# Altium schematic sheet gs358贴片改插件方案20260723.SchDoc
size 400 x 400 mm
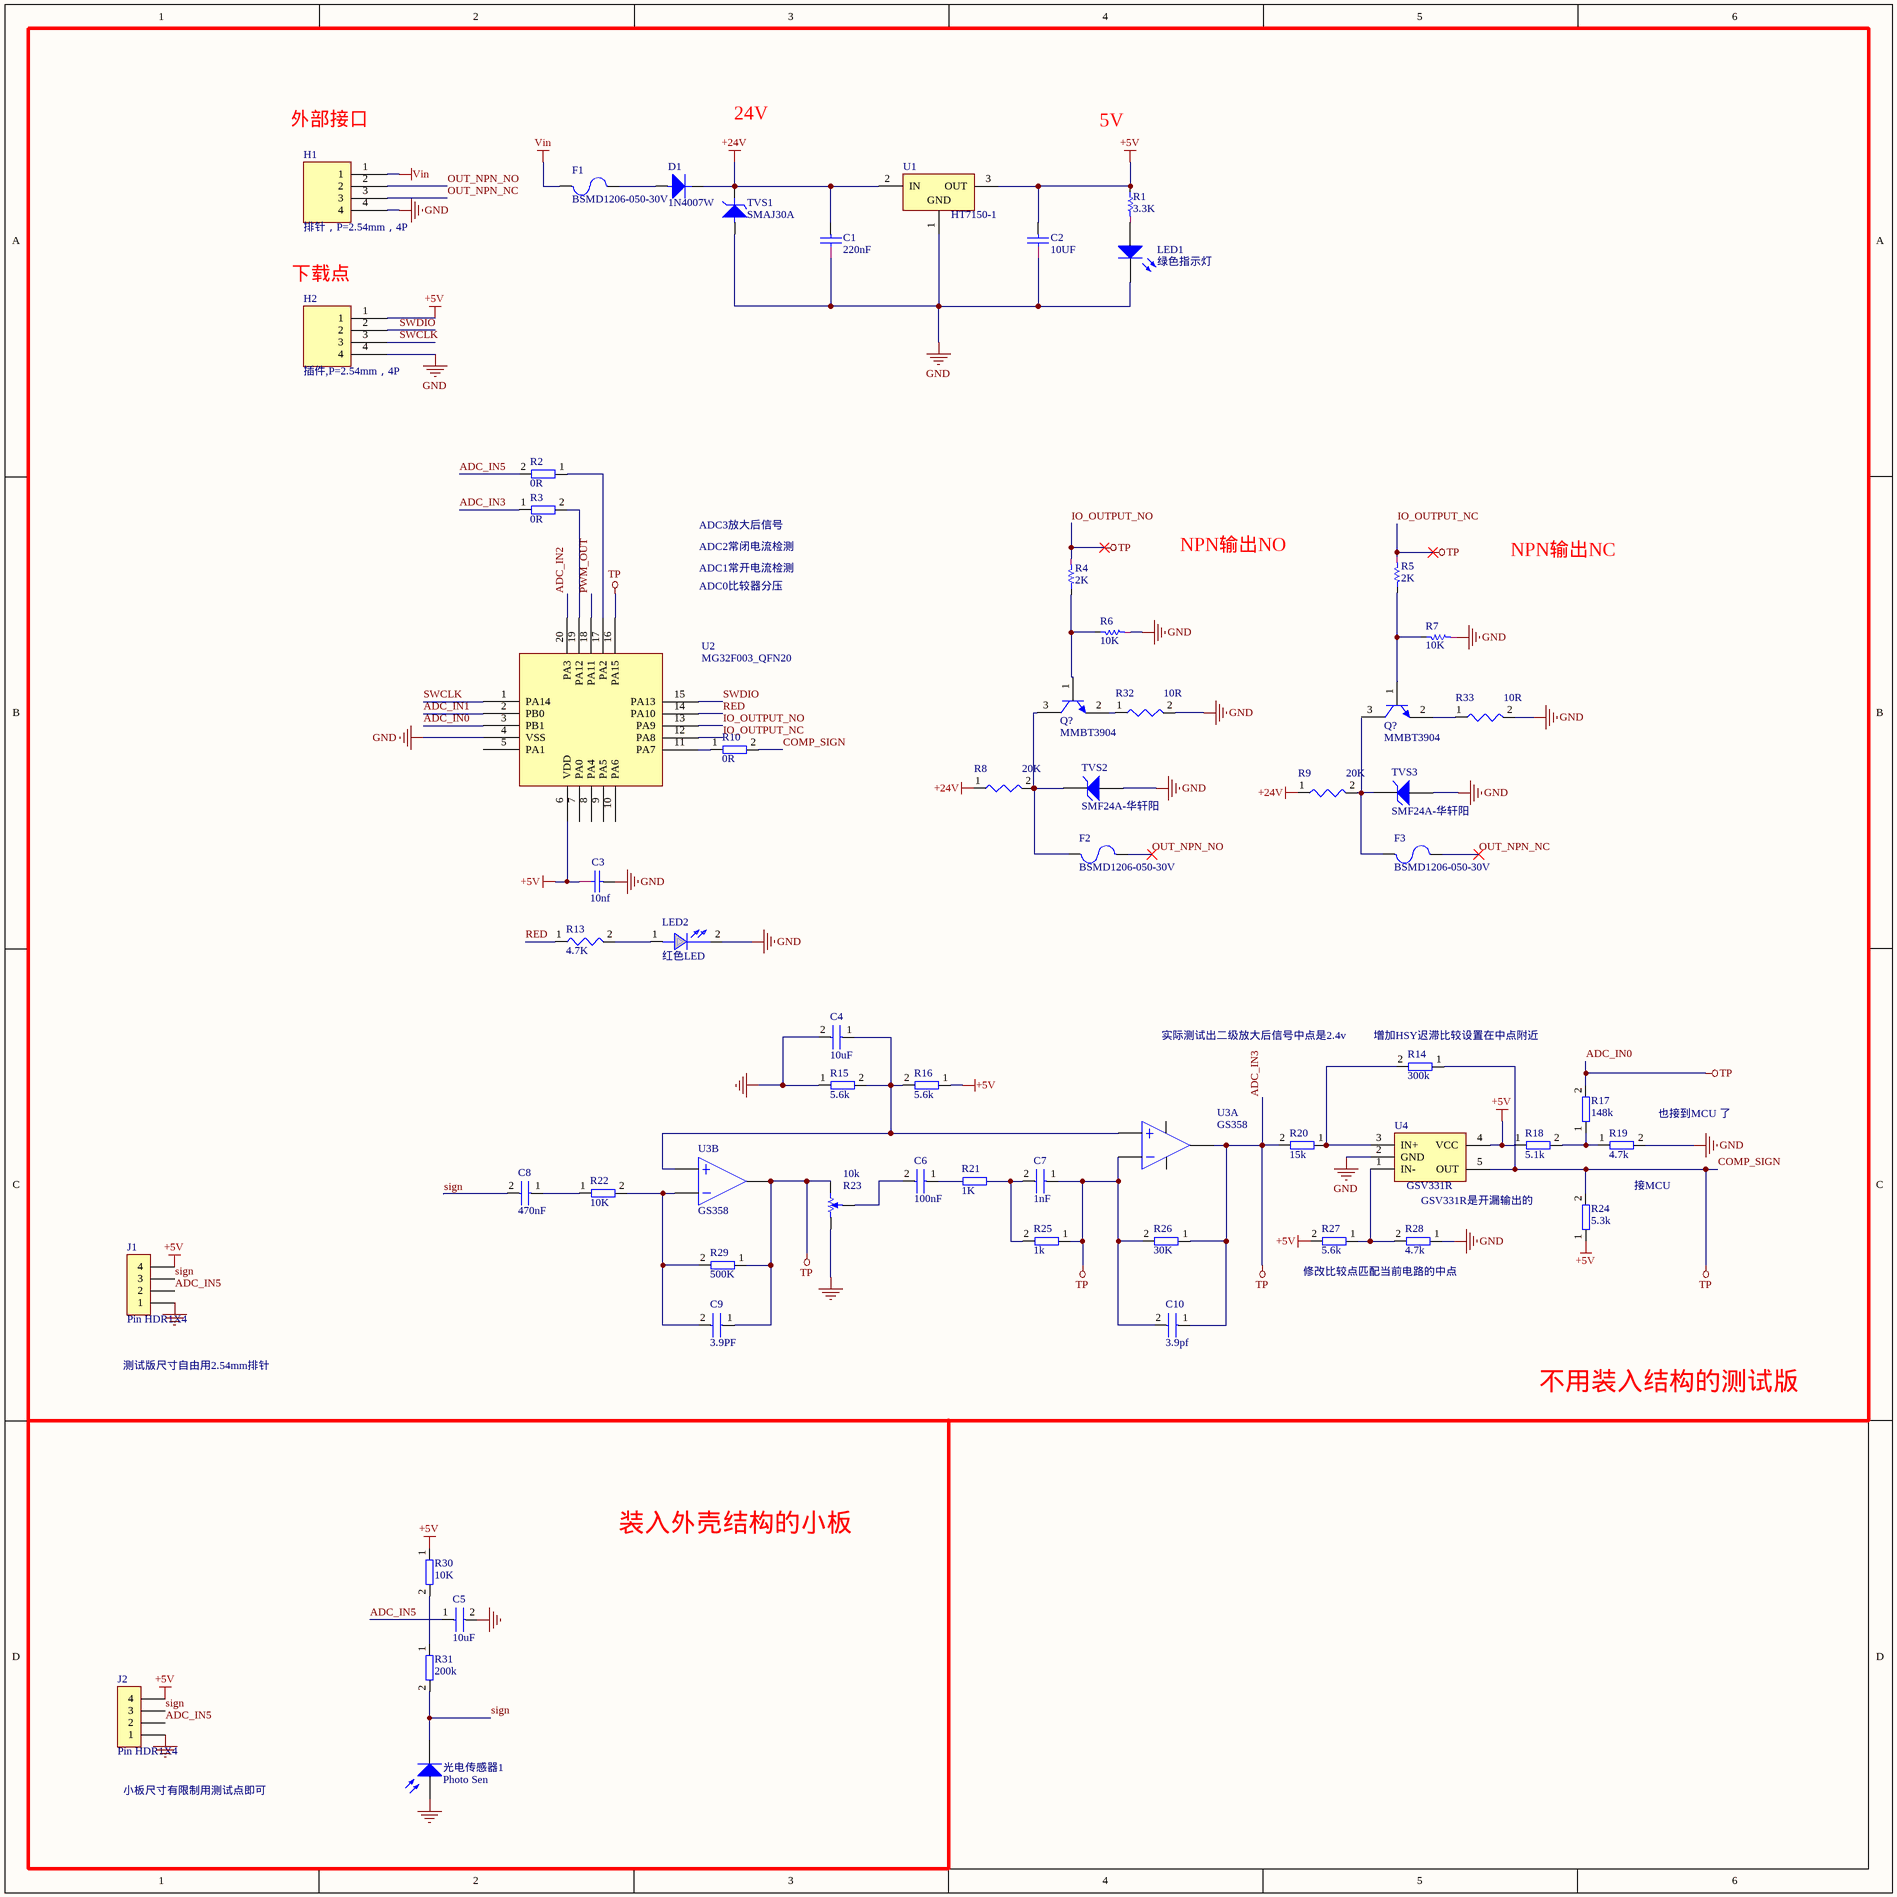
[diagram p0: gs358贴片改插件方案20260723.SchDoc]

## Parts
(Parts that share a designator on the sheet are numbered #1, #2 ... from top to bottom, then left to right.)
C1  220nF  [0603A]
C2  10UF  [0603A]
C3  10nf  [0603A]
C4  10uF
C5  10uF
C6  100nF
C7  1nF
C8  470nF
C9  3.9PF
C10  3.9pf
D1  1N4007W  [D1]
F1  BSMD1206-050-30V  [1206]
F2  BSMD1206-050-30V  [1206]
F3  BSMD1206-050-30V  [1206]
H1  排针，P=2.54mm，4P  [Pin HDR1X4/2.54mm-S]
H2  插件,P=2.54mm，4P  [Pin HDR1X4/2.54mm-S]
J1  Pin HDR1X4  [Pin HDR1X4/2.54mm-S]
J2  Pin HDR1X4  [Pin HDR1X4/2.54mm-S]
LED1  绿色指示灯  [3.2X1.6X1.1]
LED2  红色LED  [0603V]
Q?#1  MMBT3904  [TO-226-AA]
Q?#2  MMBT3904  [TO-226-AA]
R1  3.3K  [0603]
R2  0R
R3  0R
R4  2K  [0603]
R5  2K  [0603]
R6  10K  [0603]
R7  10K  [0603]
R8  20K  [0402]
R9  20K  [0402]
R10  0R
R13  4.7K  [0402]
R14  300k
R15  5.6k
R16  5.6k
R17  148k
R18  5.1k
R19  4.7k
R20  15k
R21  1K
R22  10K
R23  10k  [POT4MM-2]
R24  5.3k
R25  1k
R26  30K
R27  5.6k
R28  4.7k
R29  500K
R30  10K
R31  200k
R32  10R  [0402]
R33  10R  [0402]
TVS1  SMAJ30A  [D2]
TVS2  SMF24A-华轩阳  [GLZZ0002ZA-A]
TVS3  SMF24A-华轩阳  [GLZZ0002ZA-A]
U1  HT7150-1  [SOT89N]
U2  MG32F003_QFN20  [HT3.96-11P]
U3  GS358  [SOP-8]  (parts A,B of 2)
U4  GSV331R  [SC70]
光电传感器1  Photo Sen  [PIN2]

## Blocks framed on the sheet
不用装入结构的测试版: C1-C4 C6-C10 D1 F1-F3 H1 H2 J1 LED1 LED2 Q?#1 Q?#2 R1-R10 R13-R29 R32 R33 TVS1-TVS3 U1-U4

## Nets
+5V: C2.1 C3.2 H2.1 J1.4 J2.4 R1.1 R16.1 R18.1 R24.1 R27.2 R30.1 U1.3(OUT) U2.6(VDD) U4.4(VCC)
+24V: C1.1 D1.2(K) R8.1 R9.1 TVS1.2 U1.2(IN)
ADC_IN0: C7.1 C9.1 C10.1 C10.2 R3.1 R4.2 R5.2 R10.2 R14.1 R17.2 R20.2 R23.CW(+) R24.2 R25.1 R26.1 R26.2 R29.1 U2.3(PB1) U2.12(PA8) U2.13(PA9) U2.16(PA15) U3.1 U3.2 U3.7 U4.5(OUT)  [also labelled ADC_IN3, COMP_SIGN, IO_OUTPUT_NC, IO_OUTPUT_NO, TP]
GND: C1.2 C2.2 C3.1 C4.2 C5.2 H1.4 H2.4 J1.1 J2.1 LED1.2(K) LED2.2(CATHODE) R6.2 R7.2 R15.1 R19.2 R23.CCW(-) R28.1 R32.2 R33.2 TVS1.1 TVS2.2(A) TVS3.2(A) U1.1(GND) U2.4(VSS) U4.2(GND) 光电传感器1.1(A)
Vin: F1.2 H1.1
ADC_IN1: U2.2(PB0)
ADC_IN2: U2.20(PA3)
ADC_IN5: C5.1 J1.2 J2.2 R2.2
OUT_NPN_NC: F3.2 H1.3
OUT_NPN_NO: F2.2 H1.2
PWM_OUT: U2.18(PA11)
RED: R13.1 U2.14(PA10)
sign: C8.2 J1.3 J2.3 R31.2 光电传感器1.2(K)
SWCLK: H2.3 U2.1(PA14)
SWDIO: H2.2 U2.15(PA13)
NetC4_1: C4.1 R15.2 R16.2 U3.3 U3.5
NetC6_2: C6.2 R23.W
NetC7_2: C7.2 R25.2
NetC8_1: C8.1 R22.1
NetC9_2: C9.2 R22.2 R29.2 U3.6
NetD1_1: D1.1(A) F1.1
NetF2_1: F2.1 Q?#1.3(C) R8.2 TVS2.1(K)
NetF3_1: F3.1 R9.2 TVS3.1(K)
NetLED1_1: LED1.1(A) R1.2
NetLED2_1: LED2.1(ANODE) R13.2
NetQ?#1_1: Q?#1.1(B) R4.1 R6.1
NetQ?#1_2: Q?#1.2(E) R32.1
NetQ?#2_1: Q?#2.1(B) R5.1 R7.1
NetQ?#2_2: Q?#2.2(E) R33.1
NetR2_1: R2.1 U2.17(PA2)
NetR3_2: R3.2 U2.19(PA12)
NetR10_1: R10.1 U2.11(PA7)
NetR14_2: R14.2 R20.1 U4.3(IN+)
NetR17_1: R17.1 R18.2 R19.1
NetR27_1: R27.1 R28.2 U4.1(IN-)
NetR30_2: R30.2 R31.1

Not connected (* = marked no-connect by the designer): C6 1; Q?#2 3(C); R21 1 2; U2 5(PA1) 7(PA0) 8(PA4) 9(PA5) 10(PA6); U3 4 8

## Notes on the sheet
- 外部接口
- 24V
- 5V
- 下载点
- ADC3放大后信号
- ADC0比较器分压
- ADC1常开电流检测
- ADC2常闭电流检测
- NPN输出NO
- NPN输出NC
- 实际测试出二级放大后信号中点是2.4v
- (near R14) 增加HSY迟滞比较设置在中点附近
- (near R19) 也接到MCU 了
- 接MCU
- GSV331R是开漏输出的
- 修改比较点匹配当前电路的中点
- 测试版尺寸自由用2.54mm排针
- 装入外壳结构的小板
- 小板尺寸有限制用测试点即可

## Library data of the parts
C1 C2 = CAP: Capacitor
C3 = CAP: 陶瓷电容
C4-C10 = CAP
D1 = DIODE
F1-F3 = FUSE
H1 H2 = 4P接线端2mm间距
LED1 = LED2: Typical RED, GREEN, YELLOW, AMBER GaAs LED; Published: 8-Jun-2000; LatestRevisionDate: 17-Jul-2002; LatestRevisionNote: Re-released for DXP Platform.; PackageVersion: Feb-2002; PackageReference: 3.2X1.6X1.1; Publisher: Altium Limited; PackageDescription: SM LED; 2 Flat Leads
LED2 = LED: Text Field1: 40; Text Field2: 20
Q?#1 Q?#2 = NPN: NPN Bipolar Transistor; Published: 8-Jun-2000; LatestRevisionDate: 17-Jul-2002; LatestRevisionNote: Re-released for DXP Platform.; PackageReference: TO-226-AA; Publisher: Altium Limited; PackageDescription: TO, Flat Index; 3 In-Line, Axial Leads; Body Dia. 4.8mm; Leads 0.55 x 0.51 mm (max); Code_JEDEC: TO-226-AA
R1 R4-R7 = RAS
R2 R3 R10 R14-R22 R24-R31 = RES
R8 R9 R13 R32 R33 = R: Text Field1: 20; Text Field2: 30
R23 = RPot SM: Square Trimming Potentiometer; Published: 17-Dec-2003; DatasheetVersion: Oct-2003; PackageReference: POT4MM-2; Publisher: Altium Limited; PackageDescription: Square Trimming Potentiometer; ComponentLink1Description: Manufacturer Link; ComponentLink1URL: http://bourns.com/2/search.html
TVS1 = DIODE V: Varactor Diode
TVS2 TVS3 = HZK20: Silicon Epitaxial Planar Zener Diodes for Stabilized Power Supply; Published: 12-Feb-2010; DatasheetVersion: Rev.3.00, May-2003; PackageVersion: Aug-2005; PackageReference: GLZZ0002ZA-A; Publisher: Altium Limited; PackageDescription: Metal Electrode Face (MELF) Diode; Body 3.5 x 1.35 mm (LxDia); ComponentLink1Description: Manufacturer Link; ComponentLink1URL: http://sg.renesas.com/fmwk.jsp?cnt=diode_landing.jsp&fp=/products/discrete/diodes/; ComponentLink2Description: Datasheet; ComponentLink2URL: http://documentation.renesas.com/eng/products/diode/rej03g0018_hzk.pdf; ComponentLink3Description: Packaging Specification; ComponentLink3URL: http://sg.renesas.com/media/products/common_info/package/pdf/diode/code/glzz0002za_a.pdf
U1 = HT7530-1: 3.0V 100mA Low Power,  Low Dropout Voltage (LDO) Regulator; Published: 30-Mar-2007; DatasheetVersion: rev1.50, Jan-2006; PackageVersion: Jan-2006; PackageReference: SOT-89; Publisher: Altium Limited; PackageDescription: 3-Pin SOT-89 Package 1.5 mm Pitch, 4.1 mm Lead Span; Code_IPC: SOT89; ComponentLink1Description: Manufacturer Link; ComponentLink1URL: http://www.holtek.com/; ComponentLink2Description: Datasheet; ComponentLink2URL: http://www.holtek.com/pdf/consumer/75xx_1v150.pdf
U2 = MG32F003-QFN20: QFN20主控芯片
U3 = LM358
U4 = C65
光电传感器1 = Photo Sen: Photosensitive Diode; Published: 24-Mar-1999; LatestRevisionDate: 17-Jul-2002; LatestRevisionNote: Re-released for DXP Platform.; PackageReference: PIN2; Publisher: Altium Limited